# Altium schematic sheet Sheet1.SchDoc
size A2
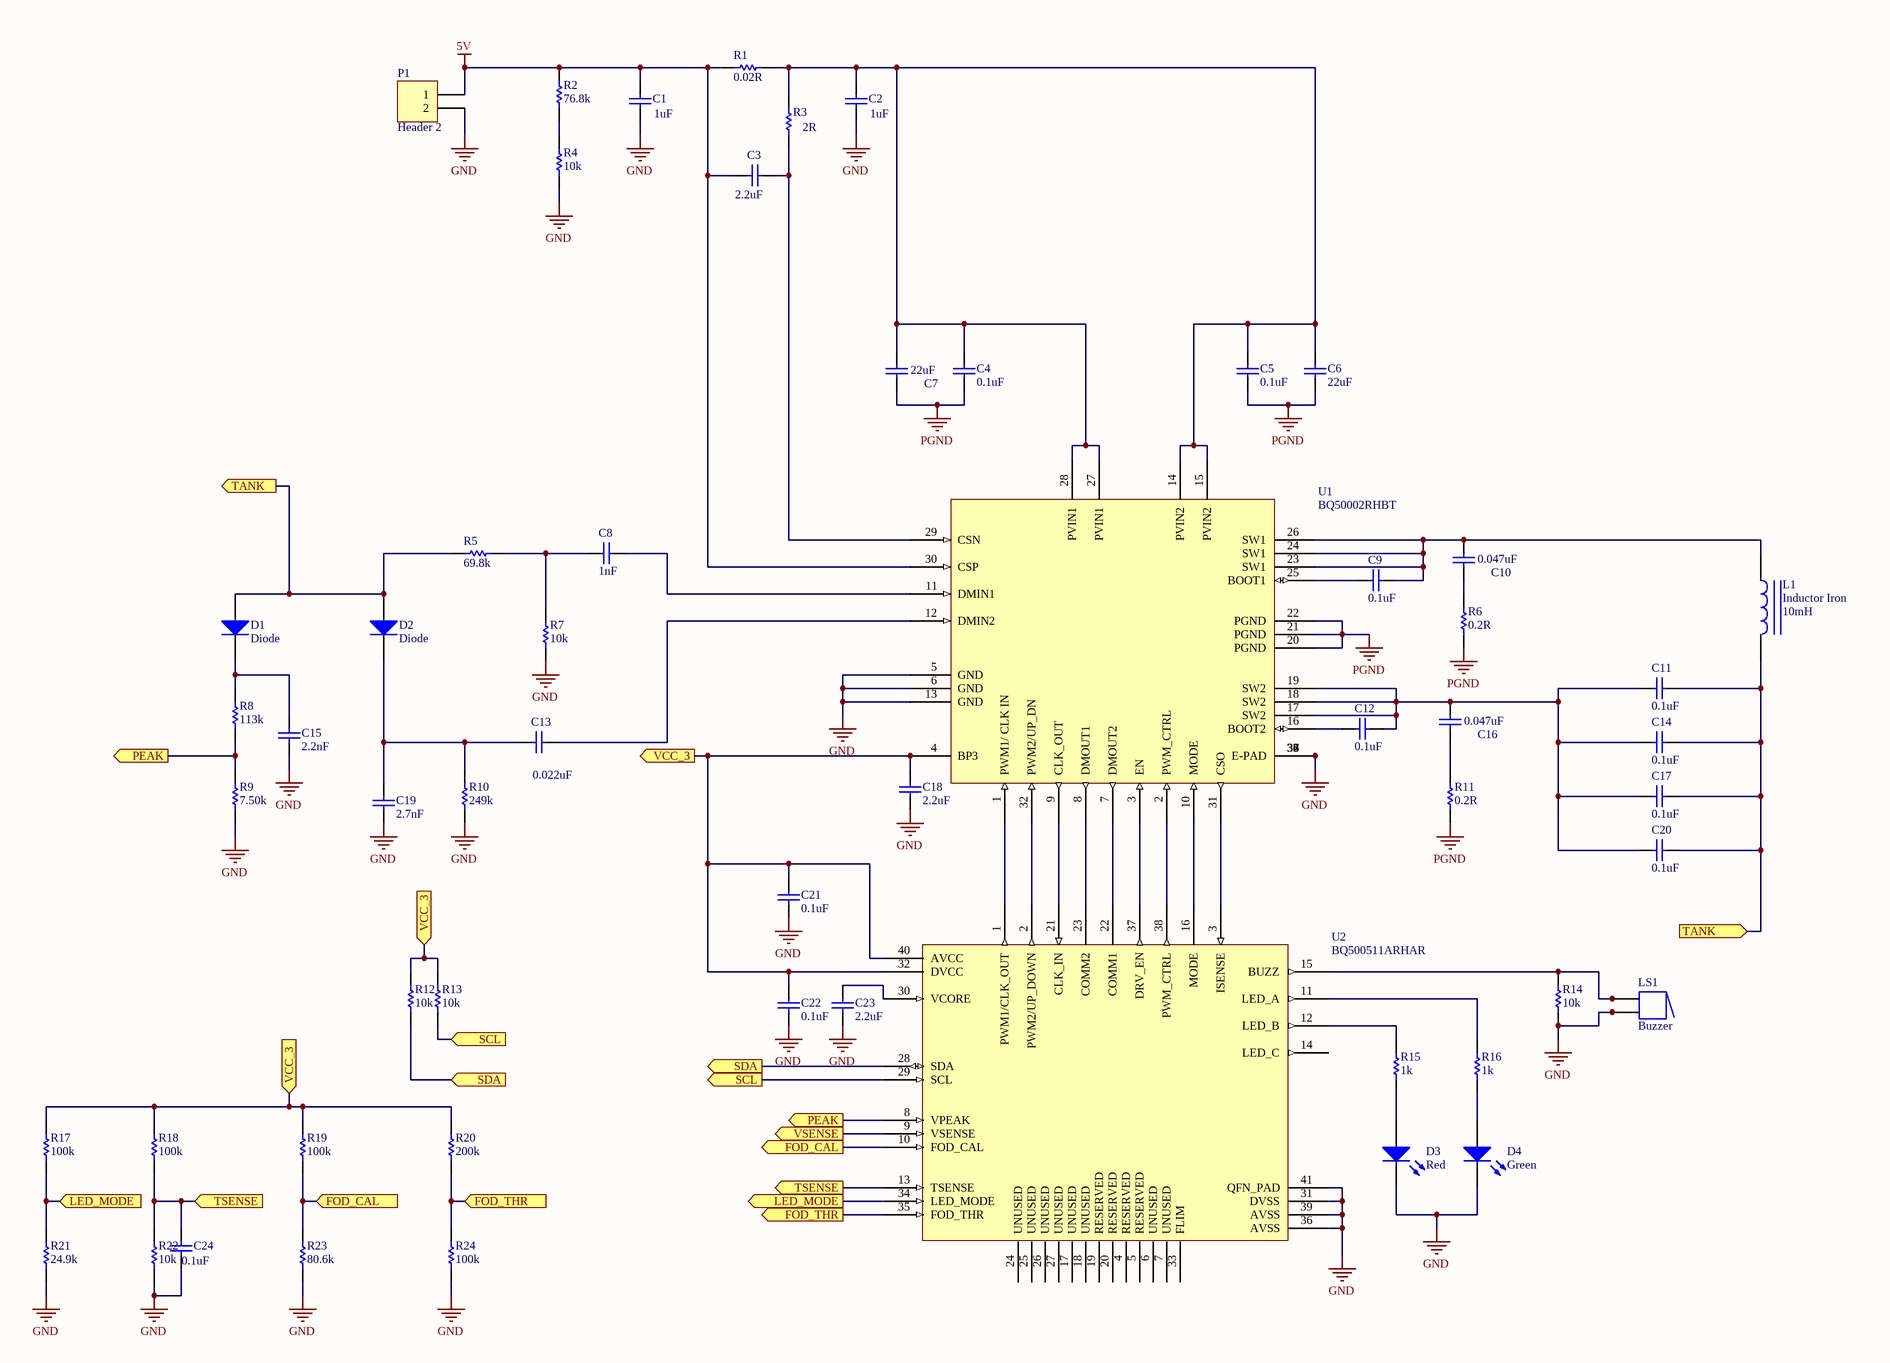
[diagram p0: Sheet1.SchDoc]

## Parts
C1  1uF  [RAD-0.3]
C2  1uF  [RAD-0.3]
C3  2.2uF  [RAD-0.3]
C4  0.1uF  [RAD-0.3]
C5  0.1uF  [RAD-0.3]
C6  22uF  [RAD-0.3]
C7  22uF  [RAD-0.3]
C8  1nF  [RAD-0.3]
C9  0.1uF  [RAD-0.3]
C10  0.047uF  [RAD-0.3]
C11  0.1uF  [RAD-0.3]
C12  0.1uF  [RAD-0.3]
C13  0.022uF  [RAD-0.3]
C14  0.1uF  [RAD-0.3]
C15  2.2nF  [RAD-0.3]
C16  0.047uF  [RAD-0.3]
C17  0.1uF  [RAD-0.3]
C18  2.2uF  [RAD-0.3]
C19  2.7nF  [RAD-0.3]
C20  0.1uF  [RAD-0.3]
C21  0.1uF  [RAD-0.3]
C22  0.1uF  [RAD-0.3]
C23  2.2uF  [RAD-0.3]
C24  0.1uF  [RAD-0.3]
D1  Diode  [SMC]
D2  Diode  [SMC]
D3  Red  [LED-1]
D4  Green  [LED-1]
L1  Inductor Iron  value 10mH  [AXIAL-0.9]
LS1  Buzzer  [ABSM-1574]
P1  Header 2  [HDR1X2]
R1  0.02R  [AXIAL-0.3]
R2  76.8k  [AXIAL-0.3]
R3  2R  [AXIAL-0.3]
R4  10k  [AXIAL-0.3]
R5  69.8k  [AXIAL-0.3]
R6  0.2R  [AXIAL-0.3]
R7  10k  [AXIAL-0.3]
R8  113k  [AXIAL-0.3]
R9  7.50k  [AXIAL-0.3]
R10  249k  [AXIAL-0.3]
R11  0.2R  [AXIAL-0.3]
R12  10k  [AXIAL-0.3]
R13  10k  [AXIAL-0.3]
R14  10k  [AXIAL-0.3]
R15  1k  [AXIAL-0.3]
R16  1k  [AXIAL-0.3]
R17  100k  [AXIAL-0.3]
R18  100k  [AXIAL-0.3]
R19  100k  [AXIAL-0.3]
R20  200k  [AXIAL-0.3]
R21  24.9k  [AXIAL-0.3]
R22  10k  [AXIAL-0.3]
R23  80.6k  [AXIAL-0.3]
R24  100k  [AXIAL-0.3]
U1  BQ50002RHBT  [BQ50002_VQFN-32]
U2  BQ500511ARHAR  [QFN50P600X600X100-41N]

## Ports
FOD_CAL (in), FOD_CAL (out), FOD_THR (in), FOD_THR (out), LED_MODE (in), LED_MODE (out), PEAK (out), SCL (in), SCL (out), SDA (in), SDA (out), TANK (in), TANK (out), TSENSE (in), TSENSE (out), VCC_3 (in), VCC_3 (out), VSENSE (out)

## Nets
5V: C1.2 C3.2 P1.1 R1.1 R2.1 U1.30(CSP)
GND: C1.1 C2.1 C15.2 C18.2 C19.2 C21.2 C22.2 C23.2 C24.2 D3.2(K) D4.2(K) LS1.2 LS1.2A P1.2 R4.2 R7.2 R9.2 R10.2 R14.1 R21.2 R22.2 R23.2 R24.2 U1.5(GND) U1.6(GND) U1.13(GND) U1.33(E-PAD) U1.34 U1.35 U1.36 U1.37 U1.38 U2.31(DVSS) U2.36(AVSS) U2.39(AVSS) U2.41(QFN_PAD)
PGND: C4.2 C5.2 C6.2 C7.1 R6.2 R11.2 U1.20(PGND) U1.21(PGND) U1.22(PGND)
FOD_CAL: R19.2 R23.1 U2.10(FOD_CAL) ; port FOD_CAL
FOD_THR: R20.2 R24.1 U2.35(FOD_THR) ; port FOD_THR
LED_MODE: R17.2 R21.1 U2.34(LED_MODE) ; port LED_MODE
PEAK: R8.2 R9.1 U2.8(VPEAK) ; port PEAK
SCL: R13.1 U2.29(SCL) ; port SCL
SDA: R12.1 U2.28(SDA) ; port SDA
TANK: C11.1 C14.1 C17.1 C20.1 D1.1(A) D2.1(A) L1.2 R5.1 ; port TANK
TSENSE: C24.1 R18.2 R22.1 U2.13(TSENSE) ; port TSENSE
VCC_3: C18.1 C21.1 C22.1 R12.2 R13.2 R17.1 R18.1 R19.1 R20.1 U1.4(BP3) U2.32(DVCC) U2.40(AVCC) ; port VCC_3
VSENSE: U2.9(VSENSE) ; port VSENSE
NetC2_2: C2.2 C4.1 C5.1 C6.1 C7.2 R1.2 R3.2 U1.14(PVIN2) U1.15(PVIN2) U1.27(PVIN1) U1.28(PVIN1)
NetC3_1: C3.1 R3.1 U1.29(CSN)
NetC8_1: C8.1 U1.11(DMIN1)
NetC8_2: C8.2 R5.2 R7.1
NetC9_1: C9.1 C10.2 L1.1 U1.23(SW1) U1.24(SW1) U1.26(SW1)
NetC9_2: C9.2 U1.25(BOOT1)
NetC10_1: C10.1 R6.1
NetC11_2: C11.2 C12.1 C14.2 C16.2 C17.2 C20.2 U1.17(SW2) U1.18(SW2) U1.19(SW2)
NetC12_2: C12.2 U1.16(BOOT2)
NetC13_1: C13.1 C19.1 D2.2(K) R10.1
NetC13_2: C13.2 U1.12(DMIN2)
NetC15_1: C15.1 D1.2(K) R8.1
NetC16_1: C16.1 R11.1
NetC23_1: C23.1 U2.30(VCORE)
NetD3_1: D3.1(A) R15.1
NetD4_1: D4.1(A) R16.1
NetLS1_1: LS1.1 LS1.1A R14.2 U2.15(BUZZ)
NetR2_2: R2.2 R4.1
NetR15_2: R15.2 U2.12(LED_B)
NetR16_2: R16.2 U2.11(LED_A)
NetU1_1: U1.1(PWM1/_CLK_IN) U2.1(PWM1/CLK_OUT)
NetU1_2: U1.2(PWM_CTRL) U2.38(PWM_CTRL)
NetU1_3: U1.3(EN) U2.37(DRV_EN)
NetU1_7: U1.7(DMOUT2) U2.22(COMM1)
NetU1_8: U1.8(DMOUT1) U2.23(COMM2)
NetU1_9: U1.9(CLK_OUT) U2.21(CLK_IN)
NetU1_10: U1.10(MODE) U2.16(MODE)
NetU1_31: U1.31(CSO) U2.3(ISENSE)
NetU1_32: U1.32(PWM2/UP_DN) U2.2(PWM2/UP_DOWN)

Not connected (* = marked no-connect by the designer): U2 4(RESERVED) 5(RESERVED) 6(UNUSED) 7(UNUSED) 14(LED_C) 17(UNUSED) 18(UNUSED) 19(RESERVED) 20(RESERVED) 24(UNUSED) 25(UNUSED) 26(UNUSED) 27(UNUSED) 33(FLIM)

## Library data of the parts
C1-C24 = Cap: Capacitor; Published: 8-Jun-2000; LatestRevisionDate: 17-Jul-2002; LatestRevisionNote: Re-released for DXP Platform.; PackageReference: RAD-0.3; Publisher: Altium Limited; PackageDescription: Radial Cap, Thru-Hole; 2 Leads; 0.3 in Pin Spacing
D1 D2 = Diode: Default Diode; Published: 8-Jun-2000; LatestRevisionDate: 17-Jul-2002; LatestRevisionNote: Re-released for DXP Platform.; PackageVersion: Sep-1996; PackageReference: SMC; Publisher: Altium Limited; PackageDescription: DO-214-AB/SMC; 2 C-Bend Leads; Body 7.9 x 5.9 mm, inc. leads (LxW); Code_JEDEC: DO-214-AB
D3 D4 = LED1: Typical RED GaAs LED; Published: 8-Jun-2000; LatestRevisionDate: 08-Jul-2005; LatestRevisionNote: Mech Layer 1 removed.; PackageReference: LED-1; Publisher: Altium Limited; PackageDescription: LED; 2 Leads
L1 = Inductor Iron: Magnetic-Core Inductor; Published: 24-Mar-1999; LatestRevisionDate: 17-Jul-2002; LatestRevisionNote: Re-released for DXP Platform.; PackageReference: AXIAL-0.9; Publisher: Altium Limited; PackageDescription: Axial Device, Thru-Hole; 2 Leads; 0.9 in Pin Spacing
LS1 = Buzzer: Magnetic Transducer Buzzer; Published: 24-Mar-1999; LatestRevisionDate: 17-Dec-2003; LatestRevisionNote: Schematic revised, PCB Footprint replaced.; DatasheetVersion: 17-Dec-2003; PackageReference: ABSM-1574; Publisher: Altium Limited; PackageDescription: Magnetic Transducer Buzzer; ComponentLink1Description: Manufacturer Link; ComponentLink1URL: http://www.megastar.com/linecard/buzzmode/index.php
P1 = Header 2: Header, 2-Pin; LatestRevisionDate: 17-Jul-2002; LatestRevisionNote: Re-released for DXP Platform.; Publisher: Altium Limited
R1-R24 = Res1: Resistor; Published: 8-Jun-2000; LatestRevisionDate: 17-Jul-2002; LatestRevisionNote: Re-released for DXP Platform.; PackageReference: AXIAL-0.3; Publisher: Altium Limited; PackageDescription: Axial Device, Thru-Hole; 2 Leads; 0.3 in Pin Spacing
U1 = BQ50002RHBT: Wireless Charging ICs Wireless Power Transmitter Analog Front End 32-VQFN -40 to 125; Manufacturer: Texas Instruments; Operating Supply Current: 1.5mA; Min Supply Voltage: 4.5V; Max Supply Voltage: 5.5V; Supplier 1: Arrow Electronics; Manufacturer Part Number: BQ50002RHBT; RoHS: Yes; Category: Power Management ICs; Stock 1: 2; Pricing 1: 0=1.26010, 1=0.79250 (USD); Mount: Surface Mount; Case/Package: VQFN; Number of Pins: 32; Contact Plating: Gold; Min Operating Temperature: -40°C; Max Operating Temperature: 125°C; Packaging: Cut Tape; Series: -; Lead Free: Lead Free; RoHS Compliant: Yes; Reach SVHC Compliant: Yes; ComponentLink1URL: http://www.ti.com/general/docs/lit/getliterature.tsp?genericPartNumber=BQ50002&&fileType=pdf&src-supplier=Element14; ComponentLink1Description: http://www.ti.com/general/docs/lit/getliterature.tsp?genericPartNumber=BQ50002&&fileType=pdf&src-supplier=Element14; ComponentLink2URL: http://www.ti.com/general/docs/lit/getliterature.tsp?genericPartNumber=BQ50002&&fileType=pdf&src-supplier=Avnet; ComponentLink2Description: http://www.ti.com/general/docs/lit/getliterature.tsp?genericPartNumber=BQ50002&&fileType=pdf&src-supplier=Avnet; ComponentLink3URL: http://www.ti.com/lit/ds/symlink/bq50002.pdf?src-supplier=Digi-Key; ComponentLink3Description: http://www.ti.com/lit/ds/symlink/bq50002.pdf?src-supplier=Digi-Key; ComponentLink4URL: http://www.ti.com/general/docs/lit/getliterature.tsp?genericPartNumber=BQ50002&amp;&amp;fileType=pdf&src-supplier=Farnell; ComponentLink4Description: http://www.ti.com/general/docs/lit/getliterature.tsp?genericPartNumber=BQ50002&amp;&amp;fileType=pdf&src-supplier=Farnell; ComponentLink5URL: http://www.ti.com/general/docs/lit/getliterature.tsp?genericPartNumber=BQ50002&&fileType=pdf&src-supplier=Farnell; ComponentLink5Description: http://www.ti.com/general/docs/lit/getliterature.tsp?genericPartNumber=BQ50002&&fileType=pdf&src-supplier=Farnell; Supplier Part Number 1: BQ50002RHBT
U2 = BQ500511ARHAR: Wireless Power Transmitter Controller 40-VQFN -40 to 85; Manufacturer: Texas Instruments; Operating Supply Current: 3.45mA; Supplier 1: Arrow Electronics; Manufacturer Part Number: BQ500511ARHAR; RoHS: Yes; Category: Power Management ICs; Stock 1: 1; Pricing 1: 1=4.06200 (USD); Mount: Surface Mount; Case/Package: VQFN; Packaging: Cut Tape; Lead Free: Lead Free; RoHS Compliant: Yes; ComponentLink1URL: http://www.ti.com/lit/ds/symlink/bq500511a.pdf?src-supplier=Digi-Key; ComponentLink1Description: http://www.ti.com/lit/ds/symlink/bq500511a.pdf?src-supplier=Digi-Key; Supplier Part Number 1: BQ500511ARHAR